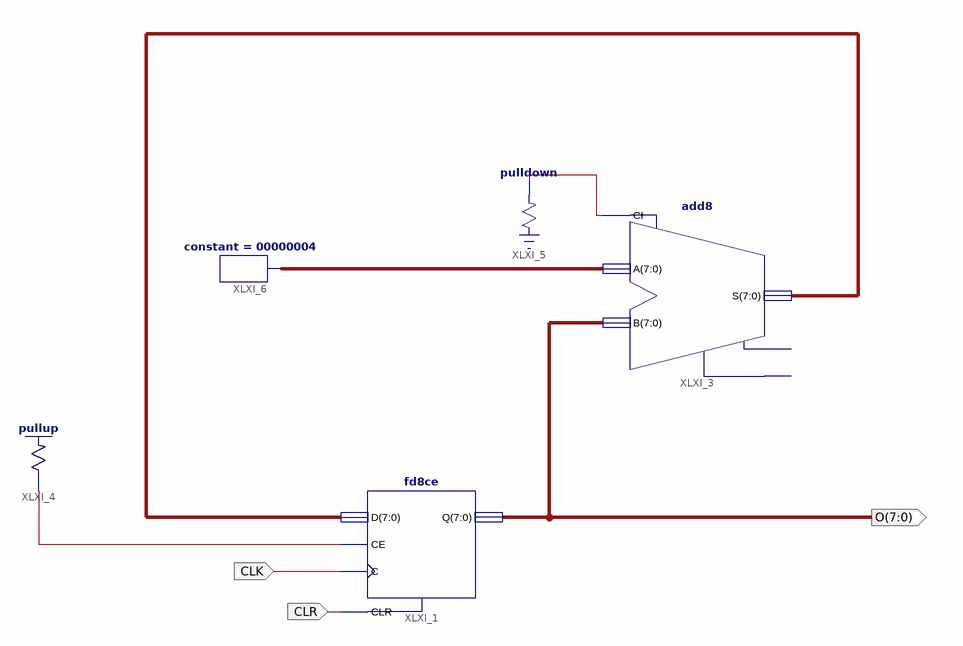
[diagram p0: schematic sheet 1]
// Xilinx ISE schematic Fetch.sch (spartan6) as structural Verilog: 5 symbols, 3 ports
module Fetch (
  input  CLK,
  input  CLR,
  output [7:0] O
);

  wire XLXN_1, XLXN_2;
  wire [7:0] XLXN_5, XLXN_10;

  fd8ce XLXI_1 (.C(CLK), .CE(XLXN_2), .CLR(CLR), .D(XLXN_10), .Q(O));
  add8 XLXI_3 (.A(XLXN_5), .B(O), .CI(XLXN_1), .S(XLXN_10));  // open: CO, OFL
  \pullup  XLXI_4 (.O(XLXN_2));
  \pulldown  XLXI_5 (.O(XLXN_1));
  constant #(.CValue("00000004")) XLXI_6 (.O(XLXN_5));
endmodule
